# EAGLE schematic ConsoleSchematic (EAGLE 7.1.0)
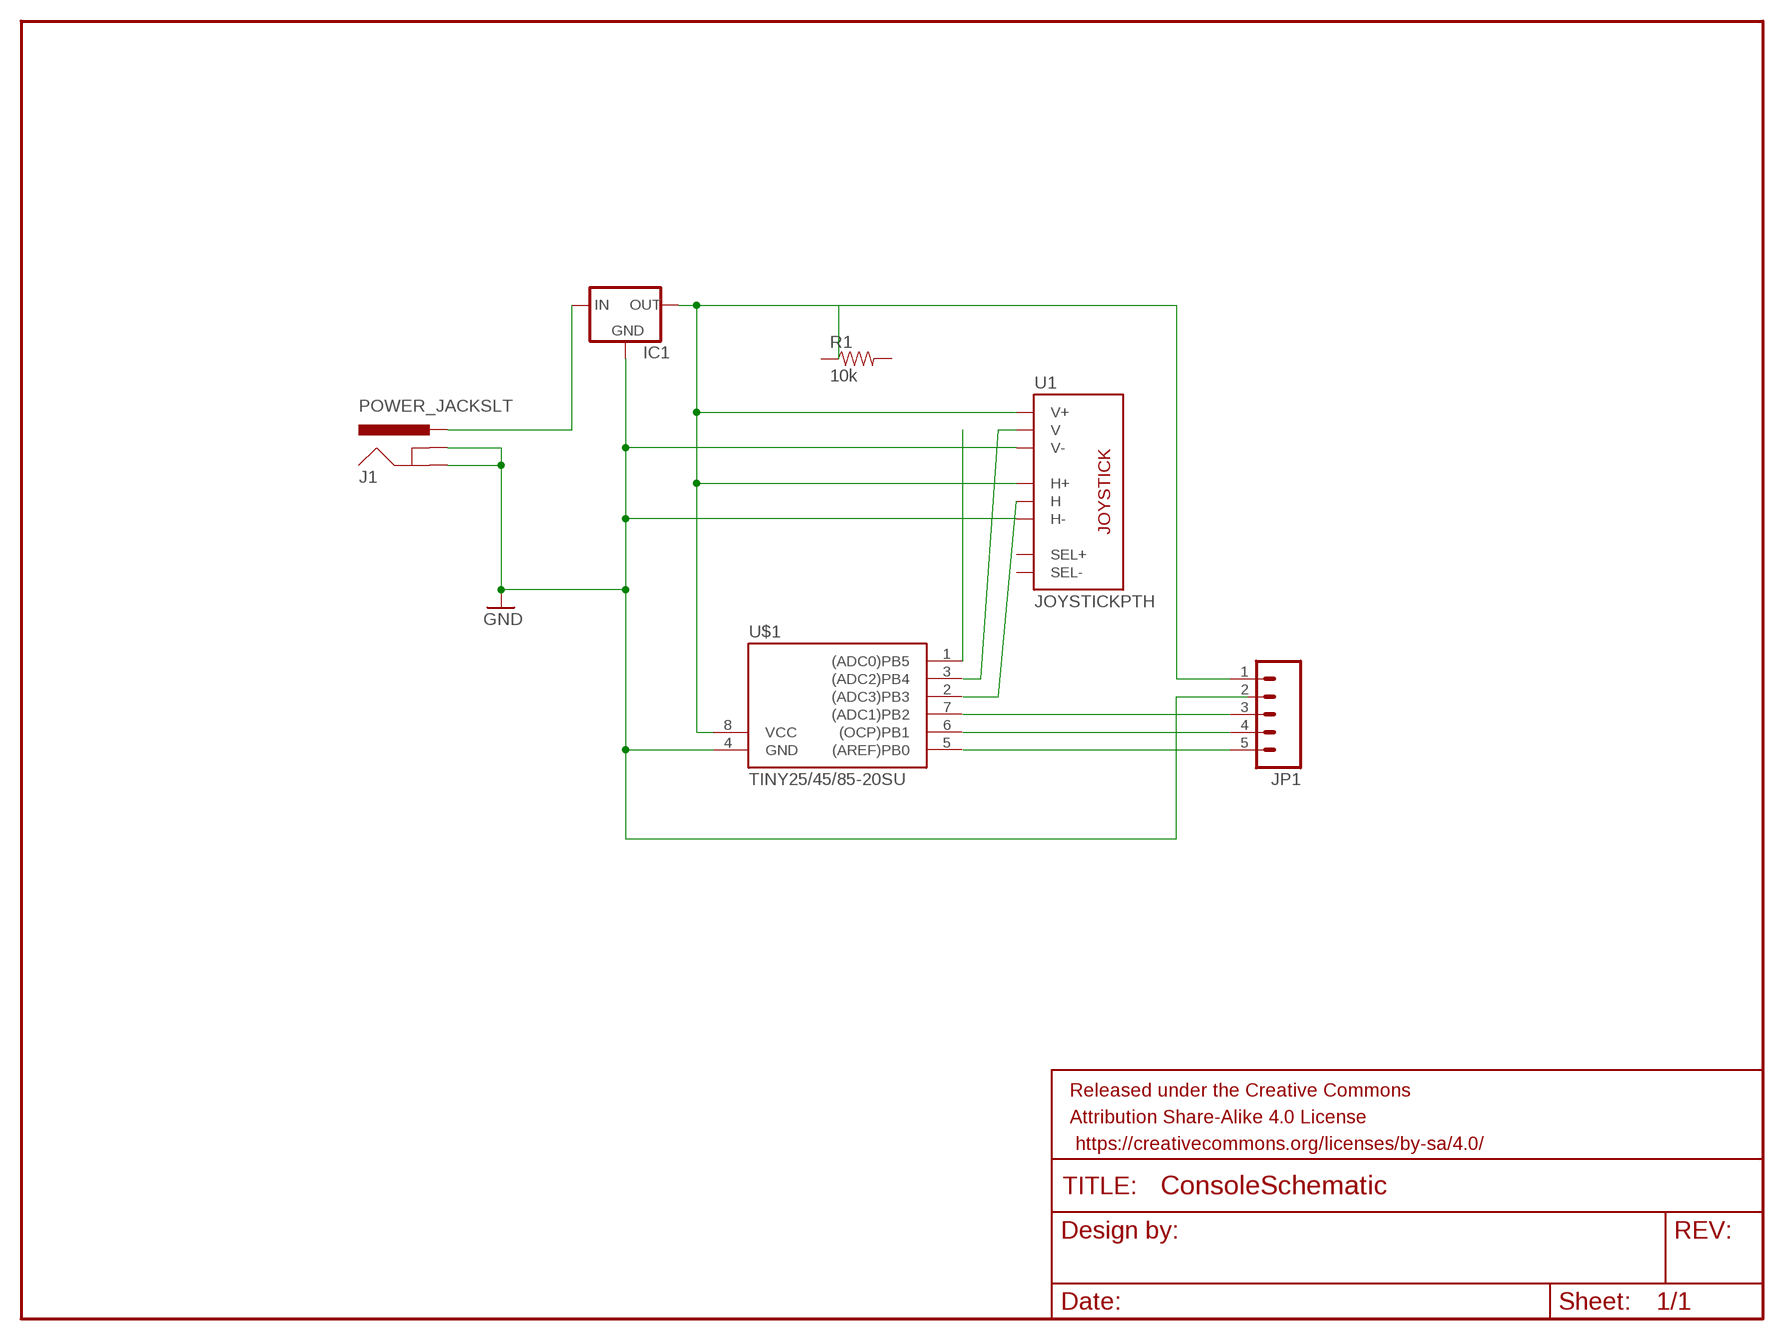
[diagram p0: schematic, sheet 1]

## Parts
FRAME1  FRAME-LETTER  [CREATIVE_COMMONS]
IC1  V_REG_78XXSIDE  [78XXL]
J1  POWER_JACKSLT  [POWER_JACK_SLOT]
JP1  M05PTH  [1X05]
R1  10k  10KOHM-1/4W-1%(PTH)HORIZ  [AXIAL-0.3]
U1  JOYSTICKPTH  [JOYSTICK]
U$1  TINY25/45/85-20SU  [SOIC8]

## Nets
GND: IC1.GND J1.GND@1(GNDBREAK) J1.GND@2(GND) U1.H3(H-) U1.V3(V-) U$1.4(GND)
N$1: IC1.IN J1.PWR
N$2: IC1.OUT U1.H1(H+) U1.V1(V+) U$1.8(VCC)
N$4: U1.V2(V)
N$5: U1.H2(H)
N$6: JP1.3
N$7: JP1.4
N$8: JP1.5
Unconnected: JP1.1 JP1.2 R1.P$1 R1.P$2 U1.B1A(SEL+) U1.B2A(SEL-) U$1.1((ADC0)PB5) U$1.2((ADC3)PB3) U$1.3((ADC2)PB4) U$1.5((AREF)PB0) U$1.6((OCP)PB1) U$1.7((ADC1)PB2)

## Library data of the parts
FRAME1 = SparkFun-Aesthetics:FRAME-LETTER: Schematic Frame Standard 8.5x11 US Letter frame
IC1 = SparkFun-PowerIC:V_REG_78XX: Voltage Regulator Standard 7805 5V regulator. IGO (Input Ground Output). Spark Fun Electronics SKU : COM-00107
J1 = SparkFun-Connectors:POWER_JACK: Power Jack This is the standard 5.5mm barrel jack for power. The PTH is the most common, proven, reliable, footprint. The Slot footprint only works if the mill layer is transmitted to the PCB fab house so be warned. Mating wall wart : TOL-00298 (and others); PROD_ID: PRT-00119
JP1 = SparkFun-Connectors:M05: Header 5 Standard 5-pin 0.1" header. Use with straight break away headers (SKU : PRT-00116), right angle break away headers (PRT-00553), swiss pins (PRT-00743), machine pins (PRT-00117), and female headers (PRT-00115). Molex polarized connector foot print use with SKU : PRT-08230 with associated crimp pins and housings.
R1 = SparkFun-Resistors:10KOHM-1/4W-1%(PTH): RES-12183; PROD_ID: RES-12183
U1 = SparkFun-Electromechanical:JOYSTICK: Thumb Joystick Joystick commonly found in PS2 controllers. Two pots and a select switch. Footprint proven. Spark Fun Electronics SKU : COM-09032
U$1 = avr-6:TINY25/45/85